# EAGLE design plytka_v3 (EAGLE 6.1)
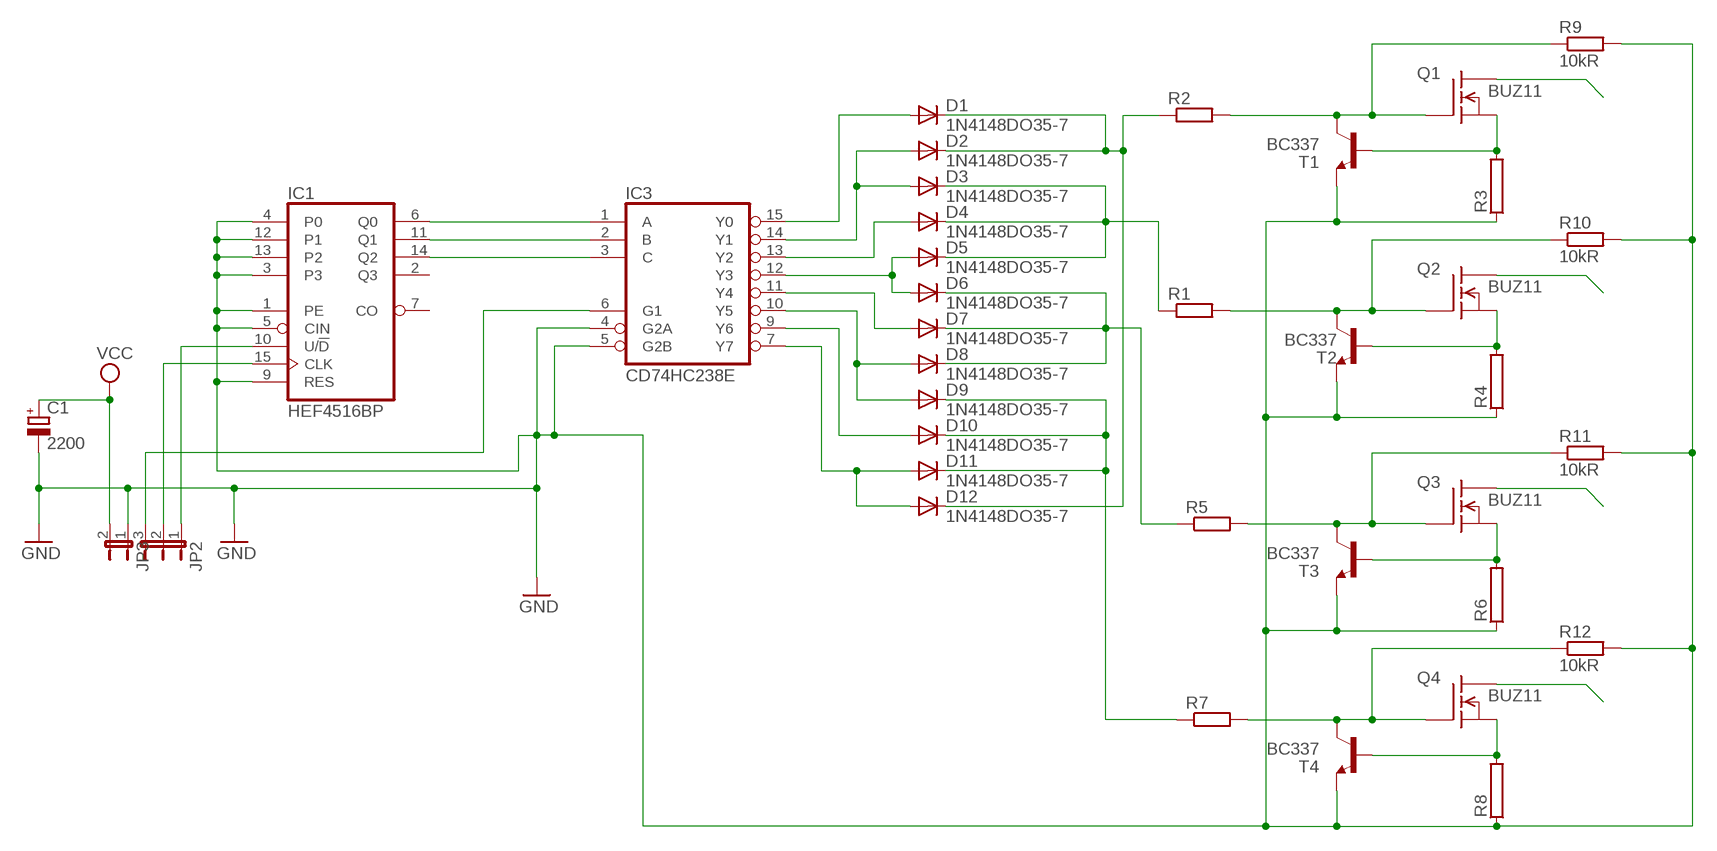
[diagram p0: schematic, sheet 1]

## Parts
C1  2200  CPOL-EUE5-10.5  [E5-10,5]
D1  1N4148DO35-7  [DO35-7]
D2  1N4148DO35-7  [DO35-7]
D3  1N4148DO35-7  [DO35-7]
D4  1N4148DO35-7  [DO35-7]
D5  1N4148DO35-7  [DO35-7]
D6  1N4148DO35-7  [DO35-7]
D7  1N4148DO35-7  [DO35-7]
D8  1N4148DO35-7  [DO35-7]
D9  1N4148DO35-7  [DO35-7]
D10  1N4148DO35-7  [DO35-7]
D11  1N4148DO35-7  [DO35-7]
D12  1N4148DO35-7  [DO35-7]
IC1  HEF4516BP  4516N  [DIL16]
IC3  CD74HC238E  74AC138N  [DIL16]
JP2  JP2E  [JP2]
JP3  JP1E  [JP1]
Q1  BUZ11  [TO220]
Q2  BUZ11  [TO220]
Q3  BUZ11  [TO220]
Q4  BUZ11  [TO220]
R1  R-EU_0207/15  [0207/15]
R2  R-EU_0207/15  [0207/15]
R3  RKH208-8R  [KH208R-8]
R4  RKH208-8R  [KH208R-8]
R5  R-EU_0207/15  [0207/15]
R6  RKH208-8R  [KH208R-8]
R7  R-EU_0207/15  [0207/15]
R8  RKH208-8R  [KH208R-8]
R9  10kR  R-EU_0207/7  [0207/7]
R10  10kR  R-EU_0207/7  [0207/7]
R11  10kR  R-EU_0207/7  [0207/7]
R12  10kR  R-EU_0207/7  [0207/7]
T1  BC337  [TO92]
T2  BC337  [TO92]
T3  BC337  [TO92]
T4  BC337  [TO92]

## Nets
GND: C1.- IC1.1(PE) IC1.3 IC1.4(P0) IC1.5(CIN) IC1.9(RES) IC1.12(P1) IC1.13(P2) IC3.4(G2A) IC3.5(G2B) JP3.1 R3.1 R4.1 R6.1 R8.1 R9.2 R10.2 R11.2 R12.2 T1.1(E) T2.1(E) T3.1(E) T4.1(E)
N$2: IC1.14(Q2) IC3.3(C)
N$3: IC1.11(Q1) IC3.2(B)
N$4: IC1.6(Q0) IC3.1(A)
N$5: IC1.15(CLK) JP2.2
N$6: IC1.10(U/!D) JP2.1
N$7: IC3.6(G1) JP2.3
N$8: D1.A IC3.15(Y0)
N$9: D2.A D3.A IC3.14(Y1)
N$10: D4.A IC3.13(Y2)
N$11: D5.A D6.A IC3.12(Y3)
N$12: D7.A IC3.11(Y4)
N$13: D8.A D9.A IC3.10(Y5)
N$14: D10.A IC3.9(Y6)
N$15: D11.A D12.A IC3.7(Y7)
N$16: D3.C D4.C D5.C R1.1
N$18: Q2.2(D)
N$19: D9.C D10.C D11.C R7.1
N$20: Q1.1(G) R2.2 R9.1 T1.3(C)
N$21: Q2.1(G) R1.2 R10.1 T2.3(C)
N$22: Q1.3(S) R3.2 T1.2(B)
N$23: Q2.3(S) R4.2 T2.2(B)
N$24: Q3.2(D)
N$25: Q4.2(D)
N$26: D6.C D7.C D8.C R5.1
N$27: Q4.1(G) R7.2 R12.1 T4.3(C)
N$30: Q3.1(G) R5.2 R11.1 T3.3(C)
N$31: Q4.3(S) R8.2 T4.2(B)
N$34: D1.C D2.C D12.C R2.1
N$46: Q3.3(S) R6.2 T3.2(B)
N$48: Q1.2(D)
VCC: C1.+ JP3.2
Unconnected: IC1.2(Q3) IC1.7(CO)

## Power pins joined to a net without a drawn wire
GND: IC1.8(VSS) IC3.8(GND)
VCC: IC1.16(VDD) IC3.16(VCC)

## Library data of the parts
C1 = rcl:CPOL-EU: POLARIZED CAPACITOR, European symbol
D1-D12 = diode:1N4148: DIODE high speed (Philips)
IC1 = 45xx:4516: Binary up down COUNTER
IC3 = 74xx-eu:74*138: 3-line to 8-line DECODER/DEMULTIPLEXER
JP2 = jumper:JP2E: JUMPER
JP3 = jumper:JP1E: JUMPER
Q1-Q4 = transistor-fet:BUZ11: N-Channel Enhancement MOSFET 50V; 30A; 0,040Ohm
R1 R2 R5 R7 R9-R12 = rcl:R-EU_: RESISTOR, European symbol
R3 R4 R6 R8 = resistor-power:R: Power Resitor; OC_FARNELL: unknown; OC_NEWARK: unknown
T1-T4 = transistor:BC337: NPN TRANSISTOR

## Board
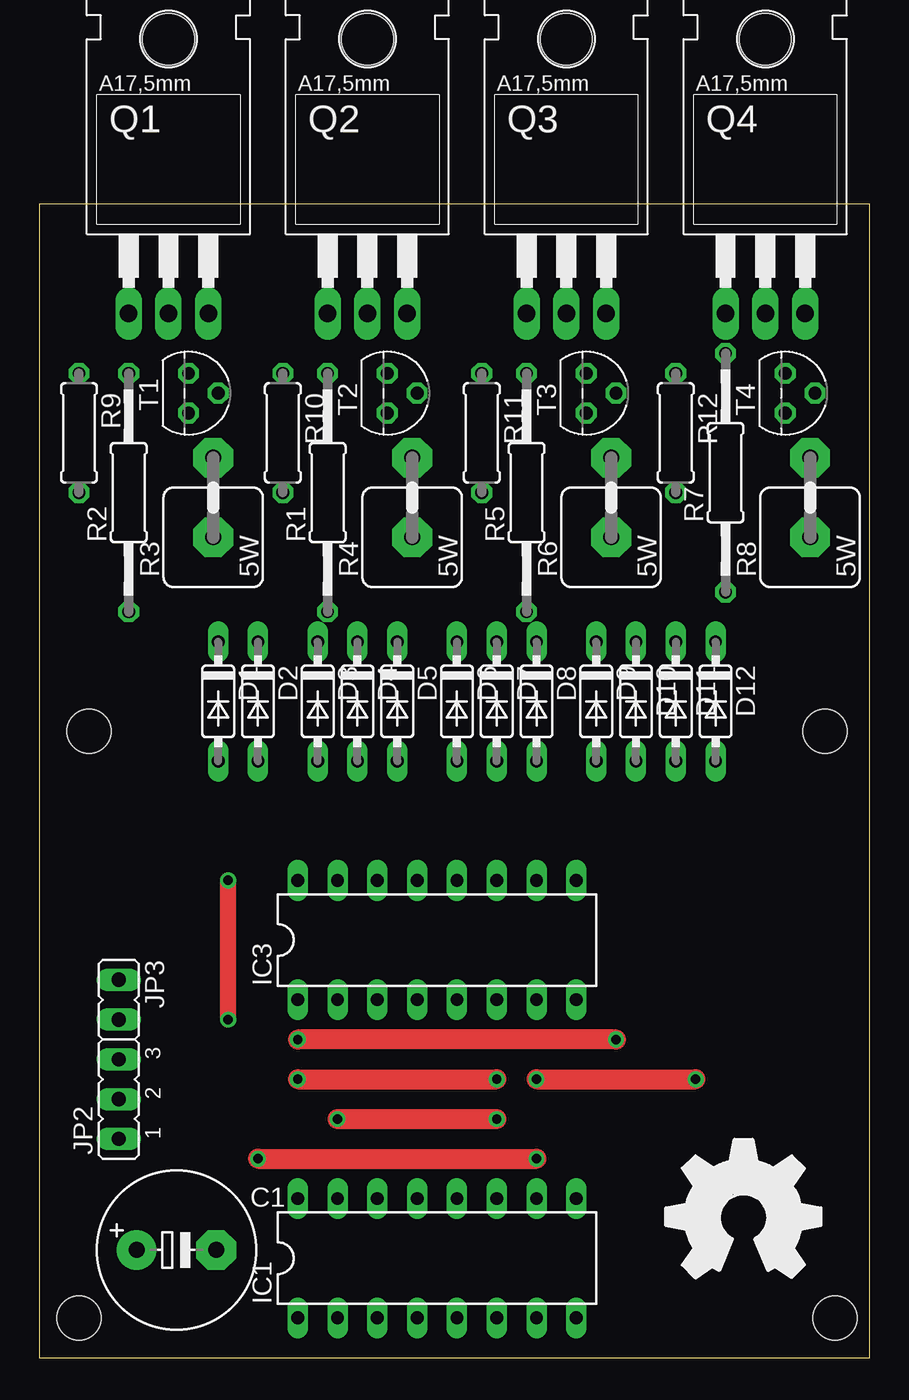
[diagram p1: board, top side]
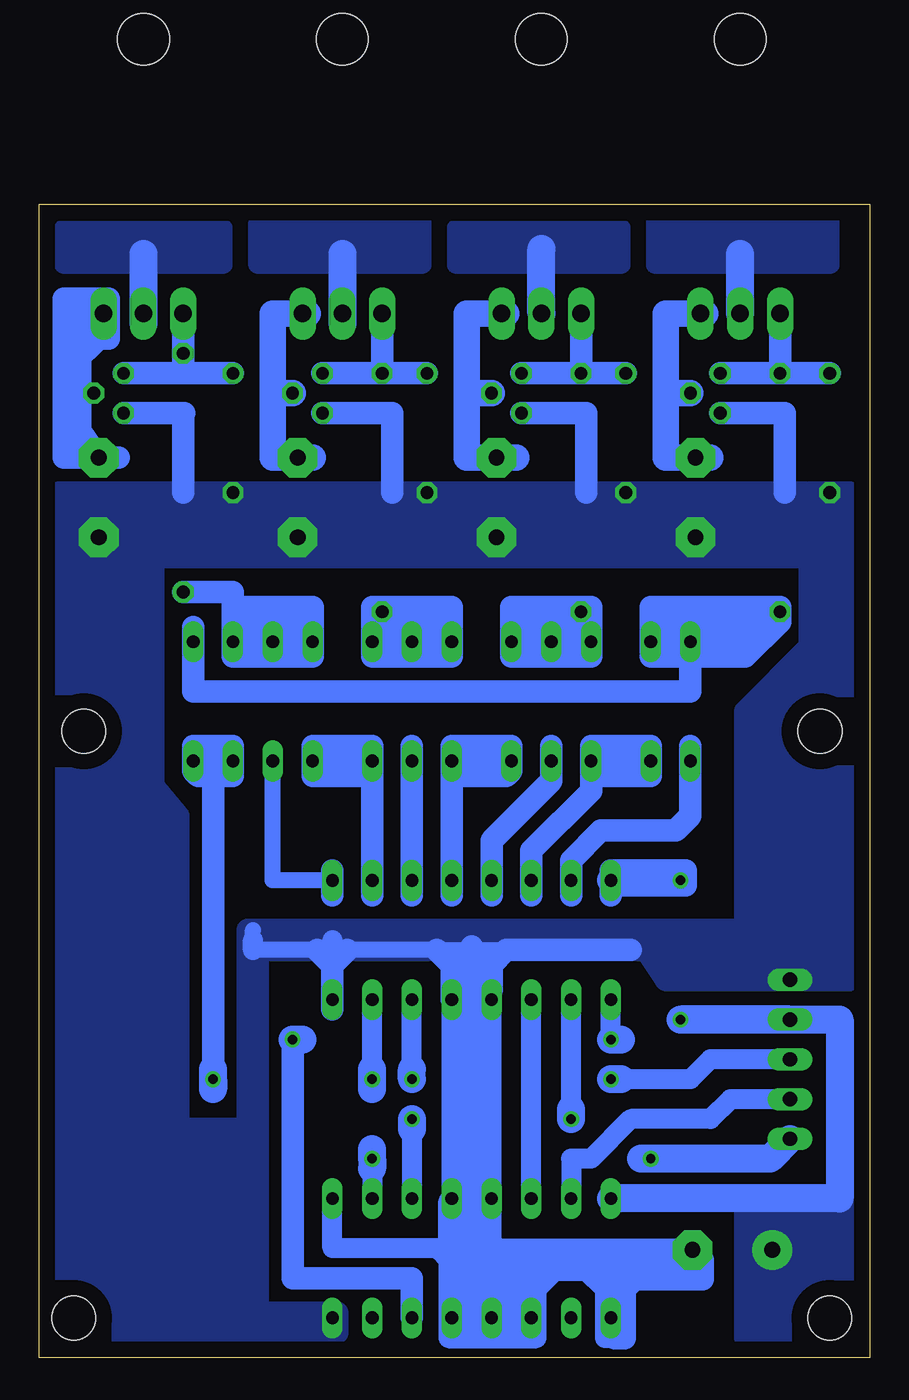
[diagram p2: board, bottom side, seen from below]

Size 53.01 x 73.65 mm. Coordinates in mm from the lower left corner, seen from the top.
Outline: 0,0 53.01,0 53.01,73.65 0,73.65 0,0
Copper layers (1*16): Top 0.035mm / dielectric 1.5mm / Bottom 0.035mm
Design rules: minimum track width 10mil, minimum drill 24mil, track to track 8mil, track to pad 8mil, pad to pad 8mil, via to via 8mil, smd to smd 8mil, copper to edge 40mil, drill to drill 8mil, minimum pad ring 10mil, minimum via ring 8mil, stop-mask expansion 4mil, vias tented up to drill 0mil, thermal gap 10mil
Holes 2.8 mm at 2.54,2.54 50.8,2.54 50.16,40.01 3.17,40.01

### Footprints (pad centres in the part's own frame; a part is rotated, then mirrored left to right if it is on the bottom)
E5-10,5 = drill 1.016 pad 2.54: + -2.54,0 | drill 1.016 pad 2.54 octagon: - 2.54,0
DO35-7 = drill 0.813 long: A 3.81,0; C -3.81,0
DIL16 = drill 0.813 long: 1 -8.89,-3.81; 2 -6.35,-3.81; 3 -3.81,-3.81; 4 -1.27,-3.81; 5 1.27,-3.81; 6 3.81,-3.81; 7 6.35,-3.81; 8 8.89,-3.81; 9 8.89,3.81; 10 6.35,3.81; 11 3.81,3.81; 12 1.27,3.81; 13 -1.27,3.81; 14 -3.81,3.81; 15 -6.35,3.81; 16 -8.89,3.81
JP2 = drill 0.914 long: 1 -2.54,0; 2 0,0; 3 2.54,0
JP1 = drill 0.914 long: 1 0,-1.27; 2 0,1.27
TO220 = drill 1.118 long: 1 -2.54,-6.35; 2 0,-6.35; 3 2.54,-6.35 | hole 3.302: 0,11.176
0207/15 = drill 0.813 octagon: 1 -7.62,0; 2 7.62,0
KH208R-8 = drill 1.016 pad 2.54 octagon: 1 -2.54,0; 2 2.54,0
0207/7 = drill 0.813 octagon: 1 -3.81,0; 2 3.81,0
TO92 = drill 0.813 octagon: 1 1.27,0; 2 0,1.905; 3 -1.27,0

### Placement (x,y rotation side)
C1  8.76,6.88 0 top
D1  11.43,41.91 270 top
D2  13.97,41.91 270 top
D3  17.78,41.91 270 top
D4  20.32,41.91 270 top
D5  22.86,41.91 270 top
D6  26.67,41.91 270 top
D7  29.21,41.91 270 top
D8  31.75,41.91 270 top
D9  35.56,41.91 270 top
D10  38.1,41.91 270 top
D11  40.64,41.91 270 top
D12  43.18,41.91 270 top
IC1  25.4,6.35 0 top
IC3  25.4,26.67 0 top
JP2  5.08,16.51 90 top
JP3  5.08,22.86 180 top
Q1  8.26,73.03 0 top
Q2  20.96,73.03 0 top
Q3  33.66,73.03 0 top
Q4  46.35,73.03 0 top
R1  18.42,55.24 90 top
R2  5.71,55.24 90 top
R3  11.11,54.93 90 top
R4  23.81,54.93 90 top
R5  31.12,55.24 90 top
R6  36.51,54.93 90 top
R7  43.81,56.52 90 top
R8  49.21,54.93 90 top
R9  2.54,59.05 270 top
R10  15.56,59.05 270 top
R11  28.26,59.05 270 top
R12  40.64,59.05 270 top
T1  9.53,61.59 270 top
T2  22.23,61.59 270 top
T3  34.92,61.59 270 top
T4  47.62,61.59 270 top
U$2  [OSHW_FILLX350_NOTEXT]  40,5.08 0 top

### Tracks (layer width: path | path; a pad name or v marks a point on that pad's centre or on a via)
GND
  Bottom 1.016: 39.37,26.04 35.24,26.04 33.34,26.04 27.62,26.04 15.24,26.04 | 39.37,26.67 39.37,27.3
  Bottom 1.27: IC1.4 24.13,6.99 | 24.13,6.99 IC1.13 IC3.4 25.4,22.86 | IC1.4 IC1.3 21.59,6.35 16.51,6.35 IC1.1 | 25.4,22.86 IC3.5 IC1.12 25.4,10.16 25.4,22.86 | 25.4,22.86 25.4,25.62 25.4,26.04 | IC1.9 34.29,6.99 24.13,6.99 | IC1.4 IC1.5 | 34.29,24.77 34.29,26.67 | 39.37,26.04 39.37,26.67
  Bottom 1.422: C1.- 16.51,6.88 | 16.51,6.88 16.51,6.35 | 16.51,6.88 23.76,6.88 24.39,7.5 | 25.4,25.62 25.4,26.25 | T1.1 5.4,60.33 5.4,55.24 | T2.1 18.1,60.33 18.1,55.24 | T3.1 30.64,60.33 30.48,60.33 30.48,55.24 | 43.81,60.33 T4.1 | 15.24,26.04 23.18,26.04 24.13,25.08 24.13,23.5 | IC3.5 26.67,25.08 27.62,26.04 | 34.29,25.08 34.29,24.77 IC3.8 34.29,22.23 | 33.34,26.04 34.29,25.08 | 35.24,26.04 34.29,25.08 | 43.76,60.33 43.81,60.33 | 43.81,60.33 43.81,55.24
  pour Bottom (no thermals): 51.75,55.24 4.13,55.24 4.13,51.12 45.72,51.12 45.72,36.51 44.13,34.61 44.13,14.61 39.69,14.61 39.69,26.04 39.05,26.04 39.05,2.86 33.97,2.86 33.97,1.59 51.75,1.59
  pour Bottom (no thermals): 1.27,55.24 3.81,55.24 3.81,45.4 7.94,41.27 7.94,27.3 39.69,27.3 39.69,26.04 14.29,26.04 13.02,24.13 1.27,24.13
N$1
  Bottom 1.27: 16.89,5.53 21.49,5.53 21.49,5.5
N$2
  Bottom 1.27: IC1.14 IC3.3
N$3  (via drill 0.6)
  Top 1.27: v19.05,15.24 v29.21,15.24
  Bottom 1.27: 29.21,14.61 IC1.11 | 19.05,15.88 IC3.2
  Bottom 1.778: v29.21,15.24 29.21,14.61 | v19.05,15.24 19.05,15.88
N$4  (via drill 0.6)
  Top 1.27: v36.83,20.32 v16.51,20.32
  Bottom 1.27: v16.51,20.32 IC3.1
  Bottom 1.422: IC1.6 29.21,5.08 36.83,5.08 v36.83,20.32
  Bottom 1.778: v36.83,20.32 36.2,20.32 | v16.51,20.32 15.88,20.32
N$5
  Bottom 1.27: IC1.15 19.05,12.7 17.78,12.7 15.24,15.24 10.16,15.24 8.89,16.51 JP2.2
N$6  (via drill 0.6)
  Top 1.27: v13.97,12.7 v31.75,12.7
  Bottom 1.27: 31.75,12.06 IC1.10
  Bottom 1.778: JP2.1 6.35,12.7 v13.97,12.7 14.61,12.7 | 31.75,12.06 v31.75,12.7 31.75,13.34
N$7  (via drill 0.6)
  Top 1.27: v16.51,17.78 v29.21,17.78
  Bottom 1.27: 29.21,18.41 IC3.6 | 15.88,17.78 11.43,17.78 10.16,19.05 JP2.3
  Bottom 1.778: 15.88,17.78 v16.51,17.78 | v29.21,17.78 29.21,18.41
N$8
  Bottom 1.016: 17.15,33.66 12.7,33.66 11.43,34.92 D1.A
  Bottom 1.422: 11.43,39.05 D1.A 11.43,34.61 12.38,33.66 17.15,33.66 19.05,31.75 IC3.15 19.05,29.53
N$9
  Bottom 1.016: D3.A D2.A | 21.59,32.38 IC3.14
  Bottom 1.422: 17.78,37.15 13.97,37.15 13.97,39.05 17.78,39.05 D3.A 17.78,37.47 17.78,37.15 | 21.59,29.53 21.59,32.38 17.78,36.2 17.78,37.15
N$10
  Bottom 1.016: 24.13,33.02 IC3.13 | 20.32,36.83 D4.A
  Bottom 1.422: 20.32,39.05 20.32,36.83 24.13,33.02 24.13,29.53
N$11
  Bottom 1.016: IC3.12 26.67,37.15 D6.A D5.A
  Bottom 1.422: 26.67,37.15 26.67,39.05 22.86,39.05 D5.A 22.86,37.47 23.18,37.15 26.67,37.15 | 26.67,29.53 26.67,37.15
N$12
  Bottom 1.016: IC3.11 D7.A
N$13
  Bottom 1.016: 31.75,37.15 IC3.10 | D8.A D9.A
  Bottom 1.422: D8.A 31.75,39.05 35.56,39.05 35.56,37.15 31.75,37.15 D8.A | 31.75,29.53 D8.A
N$14
  Bottom 1.016: IC3.9 38.1,30.48 D10.A
N$15  (via drill 0.6)
  Top 1.27: v31.75,17.78 v41.91,17.78
  Bottom 1.016: 41.91,38.1 D11.A | 41.91,38.1 D12.A | 41.91,18.41 41.91,38.1
  Bottom 1.27: 31.75,18.41 IC3.7
  Bottom 1.422: 41.91,17.46 41.91,37.15 41.59,37.47 | D11.A 40.64,39.05 43.18,39.05 43.18,37.47 42.86,37.15 40.64,37.15 D11.A
  Bottom 1.778: 31.75,18.41 v31.75,17.78 31.75,17.14 | 41.91,18.41 v41.91,17.78 41.91,17.46 41.91,17.14
N$16
  Bottom 1.016: D5.C D4.C D3.C R1.1
  Bottom 1.422: 22.86,46.67 22.86,47.94 17.78,47.94 17.78,44.77 22.86,44.77 D5.C 22.86,46.67 | 22.86,46.67 18.42,46.67 18.1,46.99
N$18
  Bottom 1.778: Q2.2 20.96,70.8
  pour Bottom: 15.88,72.07 26.35,72.07 26.35,69.85 15.88,69.85
N$19
  Bottom 1.016: D9.C D10.C D11.C
  Bottom 1.422: 40.64,47.94 35.56,47.94 35.56,44.77 40.64,44.77 D11.C 40.64,46.67 | 40.64,47.94 40.64,46.67 | 40.64,46.67 36.51,46.67 | R7.1 40.64,48.9 40.64,47.94
N$20
  Bottom 1.422: R2.2 T1.3 | R2.2 Q1.1 | R9.1 R2.2
N$21
  Bottom 1.422: R1.2 T2.3 | R1.2 Q2.1 | R10.1 R1.2
N$22
  Bottom 1.676: 10.16,57.47 R3.2 13.02,57.47 13.02,61.59 | T1.2 13.02,61.59 | 13.02,61.59 13.02,66.67 Q1.3 10.48,66.67
N$23
  Bottom 1.676: 22.54,57.47 R4.2 25.72,57.47 25.72,61.59 | T2.2 25.72,61.59 | 25.72,61.59 25.72,66.67 Q2.3 23.18,66.67
N$24
  Bottom 1.016: Q3.2 33.66,70.48
  Bottom 1.778: 33.66,70.48 33.66,66.04
  pour Bottom: 28.58,72.39 39.05,72.39 39.05,69.85 28.58,69.85
N$25
  Bottom 1.016: Q4.2 46.35,70.48
  Bottom 1.778: 46.35,70.48 46.35,66.04
  pour Bottom: 41.27,72.07 51.43,72.07 51.43,69.85 41.27,69.85
N$26
  Bottom 1.016: 30.48,45.72 D7.C D6.C | 30.48,45.72 30.48,46.67 R5.1 | 30.48,45.72 D8.C
  Bottom 1.422: D6.C 26.67,47.94 31.75,47.94 31.75,44.77 26.67,44.77 26.67,46.35 26.99,46.67 30.48,46.67
N$27
  Bottom 1.422: 43.81,62.87 T4.3 | 43.81,62.87 R7.2 Q4.1 | R12.1 43.81,62.87
N$30
  Bottom 1.422: R5.2 T3.3 | R5.2 Q3.1 | R11.1 R5.2
N$31
  Bottom 1.016: Q4.3 50.16,66.67 50.16,61.59 | 50.16,61.59 T4.2 | 50.16,57.47 50.16,61.59
  Bottom 1.422: Q4.3 48.89,65.72 48.58,65.72 | 48.58,65.72 48.58,67.63 51.43,67.63 51.43,57.47 50.16,57.47 R8.2 | R8.2 50.48,59.37 50.48,59.05 51.12,58.42 51.12,63.82 | 51.12,63.82 51.12,66.67 | 51.12,63.82 50.8,63.5 49.21,65.09 48.58,65.09 48.58,65.72 | 47.94,57.47 R8.2
N$32
  Bottom 1.422: 16.51,30.16 16.51,29.53 | 16.51,30.16 16.51,31.11 11.75,31.11 11.75,30.16 16.51,30.16
N$34
  Bottom 1.016: D1.C 11.43,42.55 | D1.C D2.C | R2.1 5.71,46.99 11.43,46.99 11.43,46.67 | 11.43,46.04 D1.C
  Bottom 1.422: 13.97,44.77 7.94,44.77 5.71,46.99 5.71,47.94 13.97,47.94 13.97,46.67 | 13.97,46.67 13.97,45.09 | 13.97,46.67 11.43,46.67 11.43,46.04 7.62,46.04 | 43.18,46.67 D12.C 43.18,42.55 11.43,42.55 11.43,44.77 11.75,45.09
N$39
  Bottom 1.27: 23.14,2.5 23.14,6.25
N$40
  Bottom 1.27: 21.26,4.38 21.26,1.25 21.89,1.25 | 21.26,4.38 21.26,5.62 | 21.89,1.25 21.89,1.88 | 21.89,1.88 21.89,6.25 | 21.89,1.25 26.89,1.25 26.89,6.25 | 26.26,6.88 26.89,6.88 | 25.64,6.88 26.26,6.88 | 25.01,6.88 25.64,6.88 | 25.01,6.88 16.26,6.88 16.26,3.75 16.26,1.88 | 16.26,1.88 16.89,1.88 | 16.89,1.88 16.89,4.38 | 16.89,4.38 16.89,5 | 26.89,6.88 26.89,6.25 | 16.89,1.88 16.89,1.25 16.26,1.25 16.26,1.88 | 25.01,6.88 25.01,2.5 | 26.26,6.88 26.26,2.5 | 16.89,4.38 18.14,5.62 | 21.26,4.38 20.01,5.62 | 26.89,6.25 27.51,6.88 | 21.89,1.88 26.26,1.88 | 26.89,6.88 26.89,10 | 25.64,6.88 25.64,9.38 26.26,10 | 25.01,6.88 25.01,10.62
  Bottom 1.422: 11.26,5 11.26,6.88 10.63,6.25 10.63,5 11.26,5 | 11.26,5 13.13,5 15.01,5 16.26,3.75 16.26,1.25 15.63,1.25 15.63,5.62 11.88,5.62
N$46
  Bottom 1.676: 35.56,57.47 R6.2 38.1,57.47 38.1,61.59 | T3.2 38.1,61.59 | 38.1,61.59 38.1,66.67 Q3.3 35.88,66.67
N$48
  Bottom 1.778: Q1.2 8.26,70.48
  pour Bottom: 2.54,72.39 13.65,72.39 13.65,69.85 2.54,69.85
N$52
  Bottom 1.422: 29.21,29.53 29.21,39.05
N$54
  Bottom 1.422: 34.29,29.53 34.29,31.11
VCC  (via drill 0.6)
  Top 1.016: v12.06,21.59 v12.06,30.48
  Bottom 1.778: JP3.2 v12.06,21.59 1.91,21.59 1.91,10.16 IC1.16 | v12.06,30.48 IC3.16
  pour Bottom (no thermals): 0.95,10.16 7.94,10.16 7.94,1.27 0.95,1.27